# EAGLE design Nusbio.TestExtension.01 (EAGLE 7.2.0)
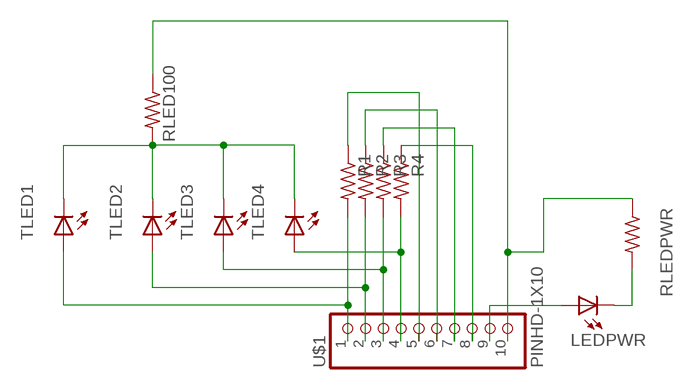
[diagram p0: schematic, sheet 1]

## Parts
LEDPWR  LEDCHIPLED_0805  [CHIPLED_0805]
R1  R-US_R0805  [R0805]
R2  R-US_R0805  [R0805]
R3  R-US_R0805  [R0805]
R4  R-US_R0805  [R0805]
RLED100  R-US_R0805  [R0805]
RLEDPWR  R-US_R0805  [R0805]
TLED1  LEDCHIPLED_0805  [CHIPLED_0805]
TLED2  LEDCHIPLED_0805  [CHIPLED_0805]
TLED3  LEDCHIPLED_0805  [CHIPLED_0805]
TLED4  LEDCHIPLED_0805  [CHIPLED_0805]
U$1  PINHD-1X10  [1X10-BIG]

## Nets
N$1: R4.1 U$1.8
N$2: RLED100.2 TLED1.C TLED2.C TLED3.C TLED4.C
N$3: RLED100.1 RLEDPWR.1 U$1.10
N$4: LEDPWR.A U$1.9
N$5: LEDPWR.C RLEDPWR.2
N$6: R4.2 TLED4.A U$1.4
N$7: R1.2 TLED1.A U$1.1
N$8: R3.1 U$1.7
N$9: R2.1 U$1.6
N$10: R1.1 U$1.5
N$11: R3.2 TLED3.A U$1.3
N$12: R2.2 TLED2.A U$1.2

## Library data of the parts
LEDPWR TLED1-TLED4 = adafruit:LED: LED OSRAM: - CHIPLED LG R971, LG N971, LY N971, LG Q971, LY Q971, LO R971, LY R971 LH N974, LH R974 LS Q976, LO Q976, LY Q976 LO Q996 - Hyper CHIPLED LW Q18S LB Q993, LB Q99A, LB R99A - SideLED LS A670, LO A670, LY A670, LG A670, LP A670 LB A673, LV A673, LT A673, LW A673 LH A674 LY A675 LS A676, LA A676, LO A676, LY A676, LW A676 LS A679, LY A679, LG A679 - Hyper Micro SIDELED® LS Y876, LA Y876, LO Y876, LY Y876 LT Y87S - SmartLED LW L88C, LW L88S LB L89C, LB L89S, LG L890 LS L89K, LO L89K, LY L89K LS L896, LA L896, LO L896, LY L896 - TOPLED LS T670, LO T670, LY T670, LG T670, LP T670 LSG T670, LSP T670, LSY T670, LOP T670, LYG T670 LG T671, LOG T671, LSG T671 LB T673, LV T673, LT T673, LW T673 LH T674 LS T676, LA T676, LO T676, LY T676, LB T676, LH T676, LSB T676, LW T676 LB T67C, LV T67C, LT T67C, LS T67K, LO T67K, LY T67K, LW E67C LS E67B, LA E67B, LO E67B, LY E67B, LB E67C, LV E67C, LT E67C LW T67C LS T679, LY T679, LG T679 LS T770, LO T770, LY T770, LG T770, LP T770 LB T773, LV T773, LT T773, LW T773 LH T774 LS E675, LA E675, LY E675, LS T675 LS T776, LA T776, LO T776, LY T776, LB T776 LHGB T686 LT T68C, LB T68C - Hyper Mini TOPLED® LB M676 - Mini TOPLED Santana® LG M470 LS M47K, LO M47K, LY M47K Source: http://www.osram.convergy.de/
R1-R4 RLED100 RLEDPWR = adafruit:R-US_: RESISTOR, American symbol
U$1 = adafruit:PINHD-1X10: Pin header 1x10 0.1" spacing With round pins

## Board
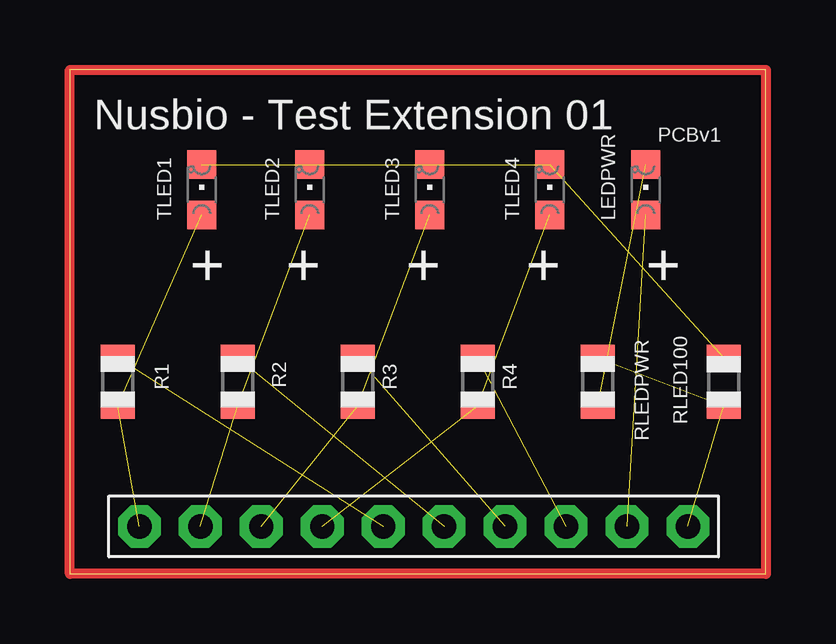
[diagram p1: board, top side]

Size 29 x 21 mm. Coordinates in mm from the lower left corner, seen from the top.
Outline: 0,0 29,0 29,21 0,21 0,0
Copper layers (1*16): Top 0.035mm / dielectric 1.5mm / Bottom 0.035mm
Design rules "default": minimum track width 10mil, minimum drill 24mil, track to track 8mil, track to pad 8mil, pad to pad 8mil, via to via 8mil, smd to smd 8mil, copper to edge 40mil, drill to drill 8mil, minimum pad ring 10mil, minimum via ring 8mil, stop-mask expansion 4mil, vias tented up to drill 0mil, thermal gap 10mil

### Footprints (pad centres in the part's own frame; a part is rotated, then mirrored left to right if it is on the bottom)
CHIPLED_0805 = smd 1.2 x 1.2: A 0,-1.05; C 0,1.05
R0805 = smd 1.1 x 1.4: 1 -1,0; 2 1,0
1X10-BIG = drill 1.016 pad 1.778 octagon: 1 -11.43,0; 2 -8.89,0; 3 -6.35,0; 4 -3.81,0; 5 -1.27,0; 6 1.27,0; 7 3.81,0; 8 6.35,0; 9 8.89,0; 10 11.43,0

### Placement (x,y rotation side)
LEDPWR  24,16 0 top
R1  2,8 270 top
R2  7,8 270 top
R3  12,8 270 top
R4  17,8 270 top
RLED100  27.25,8 90 top
RLEDPWR  22,8 270 top
TLED1  5.5,16 0 top
TLED2  10,16 0 top
TLED3  15,16 0 top
TLED4  20,16 0 top
U$1  14.33,1.97 0 top

### Tracks (layer width: path | path; a pad name or v marks a point on that pad's centre or on a via)
N$1  (1 unrouted)
N$2  (4 unrouted)
N$3  (2 unrouted)
N$4  (1 unrouted)
N$5  (1 unrouted)
N$6  (2 unrouted)
N$7  (2 unrouted)
N$8  (1 unrouted)
N$9  (1 unrouted)
N$10  (1 unrouted)
N$11  (2 unrouted)
N$12  (2 unrouted)
N$13
  Top 0.406: 0,21 29,21 29,0 0,0 0,21

### Text on the board
tNames: Nusbio - Test Extension 01 | PCBv1 | + | + | + | + | +